# Altium schematic sheet FRONT_PS.SchDoc: SDR200
size 420 x 297 mm; DocumentNumber: XXXX.468179.001 Э3; SheetNumber: 5; SheetTotal: 7; Title2str: Передняя панель; DocumentType: Схема электрическая принципиальная; Scale: 1:1
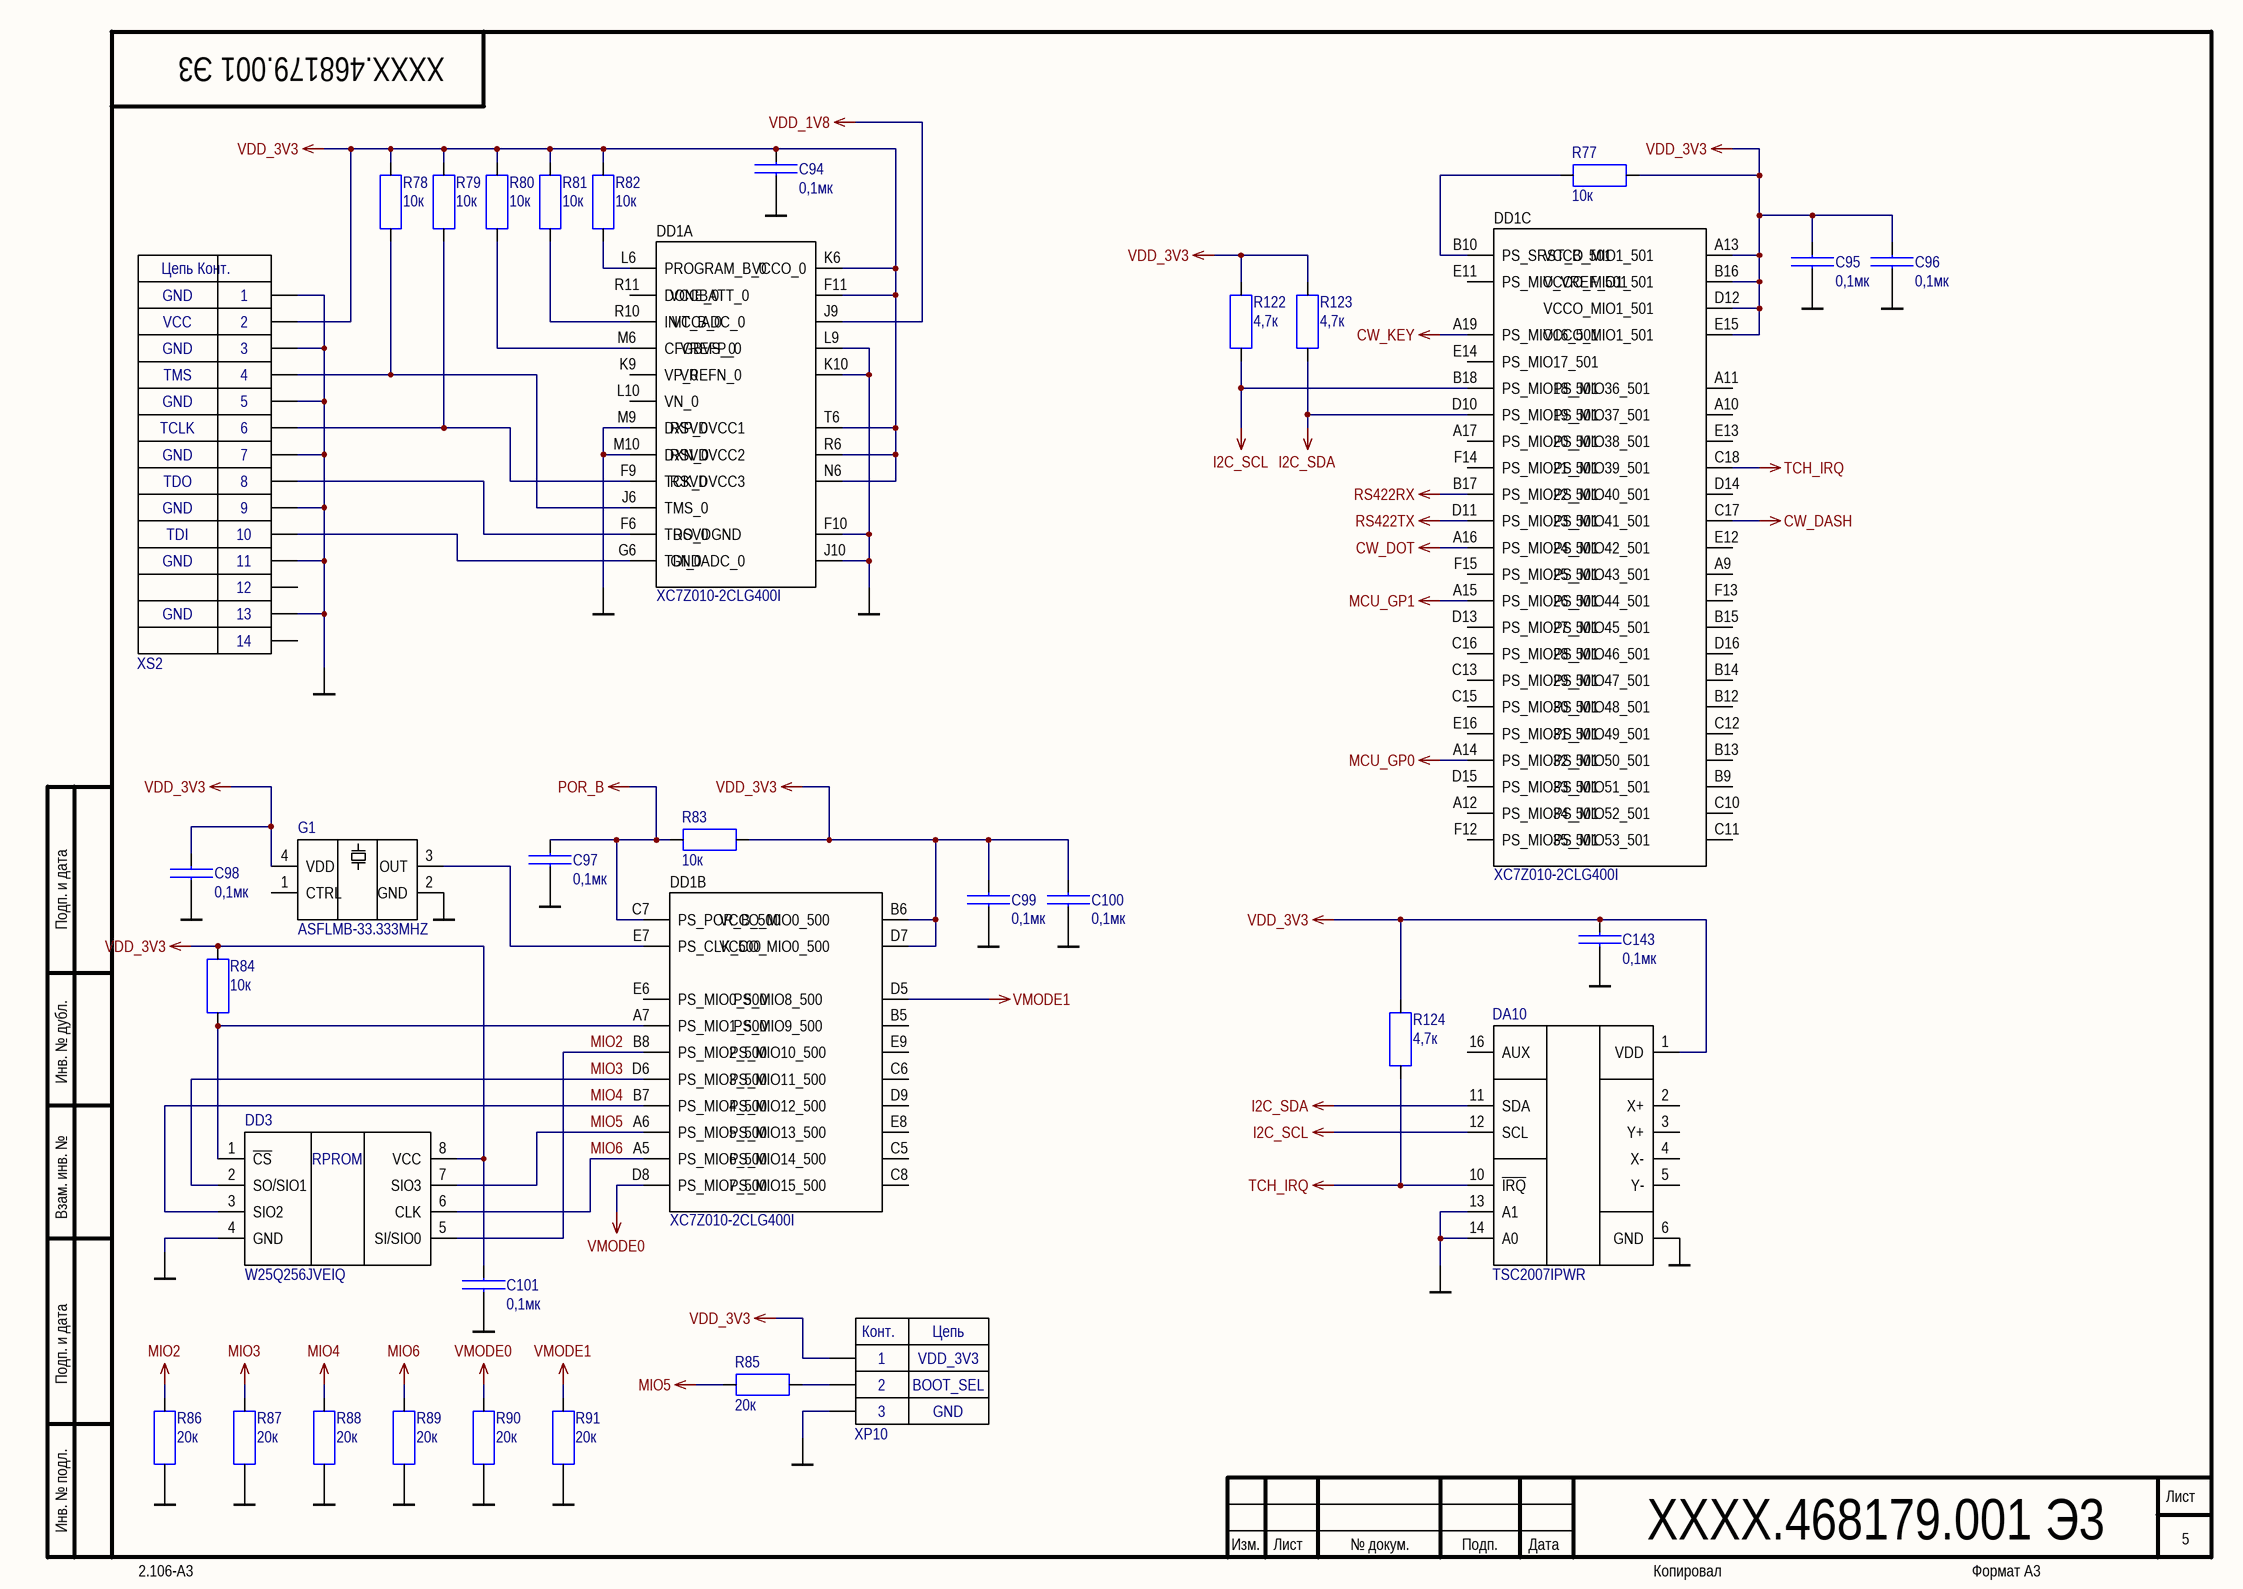
[diagram p0: FRONT_PS.SchDoc]

## Parts
C94  Nominal: 0,1мк  [CAPC1005X05L]  (hidden comment: CC0402KRX5R6BB104)
C95  Nominal: 0,1мк  [CAPC1005X05L]  (hidden comment: CC0402KRX5R6BB104)
C96  Nominal: 0,1мк  [CAPC1005X05L]  (hidden comment: CC0402KRX5R6BB104)
C97  Nominal: 0,1мк  [CAPC1005X05L]  (hidden comment: CC0402KRX5R6BB104)
C98  Nominal: 0,1мк  [CAPC1005X05L]  (hidden comment: CC0402KRX5R6BB104)
C99  Nominal: 0,1мк  [CAPC1005X05L]  (hidden comment: CC0402KRX5R6BB104)
C100  Nominal: 0,1мк  [CAPC1005X05L]  (hidden comment: CC0402KRX5R6BB104)
C101  Nominal: 0,1мк  [CAPC1005X05L]  (hidden comment: CC0402KRX5R6BB104)
C143  Nominal: 0,1мк  [CAPC1005X05L]  (hidden comment: CC0402KRX5R6BB104)
DA10  TSC2007IPWR  [TSOP65P640X120-16N]
DD1  XC7Z010-2CLG400I  [BGA400C80P20X20_1700X1700X147]  (parts A,B,C of 7)
DD3  W25Q256JVEIQ  [SON127P800X70_HS-9N]
G1  ASFLMB-33.333MHZ  [XTAL_ASFLMB-33.333MHZ-LC-T]
R77  Nominal: 10к  [RESC1005X04L]  (hidden comment: RC0402JR-0710KL)
R78  Nominal: 10к  [RESC1005X04L]  (hidden comment: RC0402JR-0710KL)
R79  Nominal: 10к  [RESC1005X04L]  (hidden comment: RC0402JR-0710KL)
R80  Nominal: 10к  [RESC1005X04L]  (hidden comment: RC0402JR-0710KL)
R81  Nominal: 10к  [RESC1005X04L]  (hidden comment: RC0402JR-0710KL)
R82  Nominal: 10к  [RESC1005X04L]  (hidden comment: RC0402JR-0710KL)
R83  Nominal: 10к  [RESC1005X04L]  (hidden comment: RC0402JR-0710KL)
R84  Nominal: 10к  [RESC1005X04L]  (hidden comment: RC0402JR-0710KL)
R85  Nominal: 20к  [RESC1005X04L]  (hidden comment: RC0402JR-0720KL)
R86  Nominal: 20к  [RESC1005X04L]  (hidden comment: RC0402JR-0720KL)
R87  Nominal: 20к  [RESC1005X04L]  (hidden comment: RC0402JR-0720KL)
R88  Nominal: 20к  [RESC1005X04L]  (hidden comment: RC0402JR-0720KL)
R89  Nominal: 20к  [RESC1005X04L]  (hidden comment: RC0402JR-0720KL)
R90  Nominal: 20к  [RESC1005X04L]  (hidden comment: RC0402JR-0720KL)
R91  Nominal: 20к  [RESC1005X04L]  (hidden comment: RC0402JR-0720KL)
R122  Nominal: 4,7к  [RESC1005X04L]  (hidden comment: RC0402JR-074K7L)
R123  Nominal: 4,7к  [RESC1005X04L]  (hidden comment: RC0402JR-074K7L)
R124  Nominal: 4,7к  [RESC1005X04L]  (hidden comment: RC0402JR-074K7L)
XP10  PLS-3  [PLS-3 (DS1021-1x3)]  (value not drawn)
XS2  IDC2-14MS  [IDC2-14MS]  (value not drawn)

## Nets
CW_DASH: DD1.C17(PS_MIO41_501)
CW_DOT: DD1.A16(PS_MIO24_501)
CW_KEY: DD1.A19(PS_MIO16_501)
GND: C94.1 C95.1 C96.1 C97.1 C98.1 C99.1 C100.1 C101.1 C143.1 DA10.6(GND) DA10.13(A1) DA10.14(A0) DD1.F10(RSVDGND) DD1.J10(GNDADC_0) DD1.K10(VREFN_0) DD1.L9(VREFP_0) DD1.M9(DXP_0) DD1.M10(DXN_0) DD3.4(GND) G1.2(GND) R86.2 R87.2 R88.2 R89.2 R90.2 R91.2 XP10.3 XS2.1 XS2.3 XS2.5 XS2.7 XS2.9 XS2.11 XS2.13
I2C_SCL: DA10.12(SCL) DD1.B18(PS_MIO18_501) R122.1
I2C_SDA: DA10.11(SDA) DD1.D10(PS_MIO19_501) R123.1
MCU_GP0: DD1.A14(PS_MIO32_501)
MCU_GP1: DD1.A15(PS_MIO26_501)
MIO2: DD1.B8(PS_MIO2_500) DD3.5(SI/SIO0) R86.1
MIO3: DD1.D6(PS_MIO3_500) DD3.2(SO/SIO1) R87.1
MIO4: DD1.B7(PS_MIO4_500) DD3.3(SIO2) R88.1
MIO5: DD1.A6(PS_MIO5_500) DD3.7(SIO3) R85.1
MIO6: DD1.A5(PS_MIO6_500) DD3.6(CLK) R89.1
POR_B: C97.2 DD1.C7(PS_POR_B_500) R83.1
RS422RX: DD1.B17(PS_MIO22_501)
RS422TX: DD1.D11(PS_MIO23_501)
TCH_IRQ: DA10.10(~{IRQ}) DD1.C18(PS_MIO39_501) R124.1
VDD_1V8: DD1.J9(VCCADC_0)
VDD_3V3: C94.2 C95.2 C96.2 C98.2 C99.2 C100.2 C101.2 C143.2 DA10.1(VDD) DD1.A13(VCCO_MIO1_501) DD1.B6(VCCO_MIO0_500) DD1.B16(VCCO_MIO1_501) DD1.D7(VCCO_MIO0_500) DD1.D12(VCCO_MIO1_501) DD1.E15(VCCO_MIO1_501) DD1.F11(VCCBATT_0) DD1.K6(VCCO_0) DD1.N6(RSVDVCC3) DD1.R6(RSVDVCC2) DD1.T6(RSVDVCC1) DD3.8(VCC) G1.4(VDD) R77.2 R78.2 R79.2 R80.2 R81.2 R82.2 R83.2 R84.2 R122.2 R123.2 R124.2 XP10.1 XS2.2
VMODE0: DD1.D8(PS_MIO7_500) R90.1
VMODE1: DD1.D5(PS_MIO8_500) R91.1
NetDD1_A7   : DD1.A7(PS_MIO1_500) DD3.1(~{CS}) R84.1
NetDD1_B10  : DD1.B10(PS_SRST_B_501) R77.1
NetDD1_E7   : DD1.E7(PS_CLK_500) G1.3(OUT)
NetDD1_F6   : DD1.F6(TDO_0) XS2.8
NetDD1_F9   : DD1.F9(TCK_0) R79.1 XS2.6
NetDD1_G6   : DD1.G6(TDI_0) XS2.10
NetDD1_J6   : DD1.J6(TMS_0) R78.1 XS2.4
NetDD1_L6   : DD1.L6(PROGRAM_B_0) R82.1
NetDD1_M6   : DD1.M6(CFGBVS_0) R80.1
NetDD1_R10  : DD1.R10(INIT_B_0) R81.1
NetR85_2: R85.2 XP10.2

Not connected (* = marked no-connect by the designer): DA10 2(X+) 3(Y+) 4(X-) 5(Y-) 16(AUX); DD1 A9   (PS_MIO43_501_____________) A10  (PS_MIO37_501_____________) A11  (PS_MIO36_501_____________) A12  (PS_MIO34_501_____________) A17  (PS_MIO20_501_____________) B5   (PS_MIO9_500______________) B9   (PS_MIO51_501_____________) B12  (PS_MIO48_501_____________) B13  (PS_MIO50_501_____________) B14  (PS_MIO47_501_____________) B15  (PS_MIO45_501_____________) C5   (PS_MIO14_500_____________) C6   (PS_MIO11_500_____________) C8   (PS_MIO15_500_____________) C10  (PS_MIO52_501_____________) C11  (PS_MIO53_501_____________) C12  (PS_MIO49_501_____________) C13  (PS_MIO29_501_____________) C15  (PS_MIO30_501_____________) C16  (PS_MIO28_501_____________) D9   (PS_MIO12_500_____________) D13  (PS_MIO27_501_____________) D14  (PS_MIO40_501_____________) D15  (PS_MIO33_501_____________) D16  (PS_MIO46_501_____________) E6   (PS_MIO0_500______________) E8   (PS_MIO13_500_____________) E9   (PS_MIO10_500_____________) E11  (PS_MIO_VREF_501__________) E12  (PS_MIO42_501_____________) E13  (PS_MIO38_501_____________) E14  (PS_MIO17_501_____________) E16  (PS_MIO31_501_____________) F12  (PS_MIO35_501_____________) F13  (PS_MIO44_501_____________) F14  (PS_MIO21_501_____________) F15  (PS_MIO25_501_____________) K9   (VP_0_____________________) L10  (VN_0_____________________) R11  (DONE_0___________________); G1 1(CTRL); XS2 12 14

## Notes on the sheet
- GND
- VDD_3V3
- BOOT_SEL
- Подп. и дата
- Инв. № дубл.
- Взам. инв. №
- Инв. № подл.
- Изм.
- Лист
- № докум.
- Подп.
- Дата
- 2.106-A3
- Копировал
- Формат А3
- (in symbol JTAG Xilinx IDC2-14MS) Цепь; Конт.; GND; VCC; TMS; TCLK; TDO; TDI
- (in symbol PLS-3) Конт.; Цепь
- (in symbol W25Q256JVEIQ) RPROM

## Library data of the parts
C94-C101 C143 = CC0402KRX5R6BB104: ЧИП конденсатор; Manufacturer: Yageo; ID: 0402 0,1 мкФ 10В X7R; Tolerance: 10%; Type: X7R; Value: 0402 0,1 мкФ 10В X7R; RuNominal: 0,1 мкФ; Voltage: 10В; ManufacturerPartNumber: CC0402KRX5R6BB104; Rem: *
DA10 = TSC2007IPWR: 1.2V to 3.6V, 12-Bit, Nanopower, 4-Wire Micro TOUCH SCREEN CONTROLLER with I / 2C™ Interface; Manufacturer: TI; Value: TSC2007IPWR; ComponentLink1Description: datasheet; ComponentLink1URL: https://static.chipdip.ru/lib/346/DOC032346667.pdf; ManufacturerPartNumber: TSC2007IPWR; Rem: *
DD1 = XC7Z010-2CLG400I: Zynq®-7000 SoC Family; Manufacturer: Xilinx; ManufacturerPartNumber: XC7Z010-2CLG400I; Value: XC7Z010-2CLG400I
DD3 = W25Q256JVEIQ: 3V 256M-BIT SERIAL FLASH MEMORY WITH DUAL/QUAD SPI; Manufacturer: WINBOND; ManufacturerPartNumber: W25Q256JVEIQ; Value: W25Q256JVEIQ
G1 = Генератор кварцевый ASFLMB-33.333MHZ: 33.333 MHz HCMOS/TTL Clock Oscillator; Manufacturer: Abracom; ManufacturerPartNumber: ASFLMB-33.333MHZ-LC; Value: 33.333 MHz
R77-R84 = RC0402JR-0710KL: ЧИП резистор; Manufacturer: Yageo; ID: 0402 10 кОм 5%; Tolerance: 5%; Value: 0402 10 кОм 5%; ManufacturerPartNumber: RC0402JR-0710KL; Rem: *; Type: *
R85-R91 = RC0402JR-0720KL: ЧИП резистор; Manufacturer: Yageo; ID: 0402 20 кОм 5%; Tolerance: 5%; Value: 0402 20 кОм 5%; ManufacturerPartNumber: RC0402JR-0720KL; Rem: *; Type: *
R122-R124 = RC0402JR-074K7L: ЧИП резистор; Manufacturer: Yageo; ID: 0402 4,7 кОм 5%; Tolerance: 5%; Value: 0402 4,7 кОм 5%; ManufacturerPartNumber: RC0402JR-074K7L; Rem: *; Type: *
XS2 = JTAG Xilinx IDC2-14MS